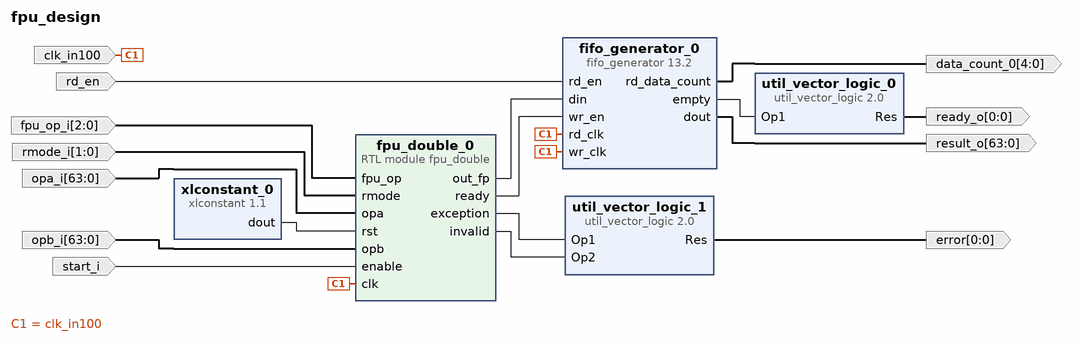
[diagram p0: block diagram of the top level]
# Vivado block design fpu_design, xc7a35ticsg324-1L, Vivado 2020.1
create_bd_design fpu_design

create_bd_port -dir I -type clk clk_in100
create_bd_port -dir I start_i
create_bd_port -dir I -from 2 -to 0 fpu_op_i
create_bd_port -dir I -from 1 -to 0 rmode_i
create_bd_port -dir I rd_en
create_bd_port -dir O -from 0 -to 0 ready_o
create_bd_port -dir O -from 0 -to 0 error
create_bd_port -dir O -from 4 -to 0 data_count_0
create_bd_port -dir I -from 63 -to 0 opa_i
create_bd_port -dir I -from 63 -to 0 opb_i
create_bd_port -dir O -from 63 -to 0 result_o

create_bd_cell -type ip -vlnv xilinx.com:ip:fifo_generator:13.2 fifo_generator_0
set_property -dict [list \
  CONFIG.Fifo_Implementation Independent_Clocks_Block_RAM \
  CONFIG.Input_Data_Width 64 \
  CONFIG.Input_Depth 32 \
  CONFIG.Output_Data_Width 64 \
  CONFIG.Performance_Options Standard_FIFO \
  CONFIG.Read_Data_Count true \
  CONFIG.Read_Data_Count_Width 5 \
  CONFIG.Reset_Pin false \
  CONFIG.Valid_Flag false \
] [get_bd_cells fifo_generator_0]
create_bd_cell -type ip -vlnv xilinx.com:ip:xlconstant:1.1 xlconstant_0
set_property -dict {CONFIG.CONST_VAL 0} [get_bd_cells xlconstant_0]
create_bd_cell -type ip -vlnv xilinx.com:ip:util_vector_logic:2.0 util_vector_logic_1
set_property -dict {CONFIG.C_OPERATION or CONFIG.C_SIZE 1} [get_bd_cells util_vector_logic_1]
create_bd_cell -type ip -vlnv xilinx.com:ip:util_vector_logic:2.0 util_vector_logic_0
set_property -dict {CONFIG.C_OPERATION not CONFIG.C_SIZE 1} [get_bd_cells util_vector_logic_0]
create_bd_cell -type module -reference fpu_double fpu_double_0

# ---- connections ----

connect_bd_net -net rd_en_0_1 [get_bd_ports rd_en] [get_bd_pins fifo_generator_0/rd_en]
connect_bd_net -net clk_in100_1 [get_bd_ports clk_in100] \
  [get_bd_pins fifo_generator_0/rd_clk] [get_bd_pins fifo_generator_0/wr_clk] [get_bd_pins fpu_double_0/clk]
connect_bd_net [get_bd_pins fifo_generator_0/rd_data_count] [get_bd_ports data_count_0]
connect_bd_net [get_bd_ports fpu_op_i] [get_bd_pins fpu_double_0/fpu_op]
connect_bd_net [get_bd_ports rmode_i] [get_bd_pins fpu_double_0/rmode]
connect_bd_net -net opa_0_1 [get_bd_ports opa_i] [get_bd_pins fpu_double_0/opa]
connect_bd_net -net opb_0_1 [get_bd_ports opb_i] [get_bd_pins fpu_double_0/opb]
connect_bd_net [get_bd_ports start_i] [get_bd_pins fpu_double_0/enable]
connect_bd_net [get_bd_pins fpu_double_0/out_fp] [get_bd_pins fifo_generator_0/din]
connect_bd_net [get_bd_pins fifo_generator_0/dout] [get_bd_ports result_o]
connect_bd_net [get_bd_pins fpu_double_0/ready] [get_bd_pins fifo_generator_0/wr_en]
connect_bd_net [get_bd_pins xlconstant_0/dout] [get_bd_pins fpu_double_0/rst]
connect_bd_net [get_bd_pins fpu_double_0/exception] [get_bd_pins util_vector_logic_1/Op1]
connect_bd_net [get_bd_pins fpu_double_0/invalid] [get_bd_pins util_vector_logic_1/Op2]
connect_bd_net [get_bd_pins util_vector_logic_1/Res] [get_bd_ports error]
connect_bd_net [get_bd_pins fifo_generator_0/empty] [get_bd_pins util_vector_logic_0/Op1]
connect_bd_net [get_bd_pins util_vector_logic_0/Res] [get_bd_ports ready_o]

validate_bd_design
save_bd_design
